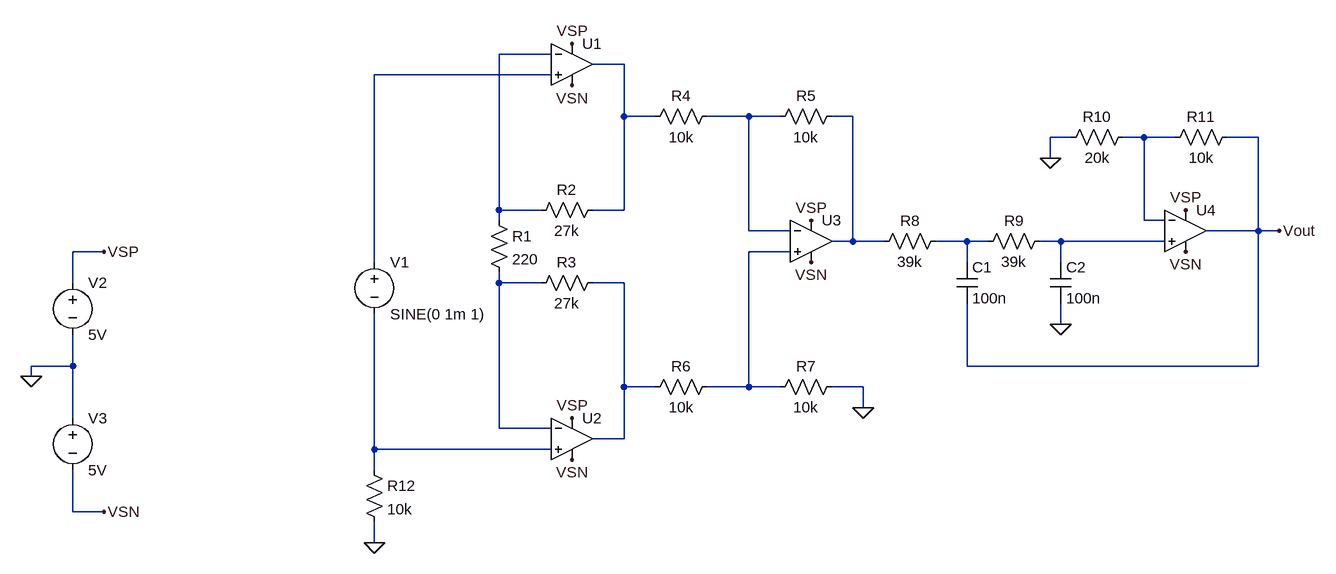
[diagram p0: schematic schema_ex1.asc]
schema_ex1.asc, the LTspice schematic file:
Version 4
SHEET 1 1656 700
WIRE 224 -96 144 -96
WIRE 336 -80 288 -80
WIRE 224 -64 -48 -64
WIRE 336 0 336 -80
WIRE 384 0 336 0
WIRE 528 0 464 0
WIRE 576 0 528 0
WIRE 688 0 656 0
WIRE 1024 32 992 32
WIRE 1136 32 1104 32
WIRE 1184 32 1136 32
WIRE 1312 32 1264 32
WIRE 992 64 992 32
WIRE 144 144 144 -96
WIRE 208 144 144 144
WIRE 336 144 336 0
WIRE 336 144 288 144
WIRE 144 160 144 144
WIRE 1136 160 1136 32
WIRE 1168 160 1136 160
WIRE 528 176 528 0
WIRE 592 176 528 176
WIRE 1312 176 1312 32
WIRE 1312 176 1232 176
WIRE 1344 176 1312 176
WIRE 688 192 688 0
WIRE 688 192 656 192
WIRE 736 192 688 192
WIRE 864 192 816 192
WIRE 896 192 864 192
WIRE 1008 192 976 192
WIRE 1168 192 1008 192
WIRE -464 208 -512 208
WIRE 592 208 528 208
WIRE -48 224 -48 -64
WIRE 864 224 864 192
WIRE 1008 224 1008 192
WIRE -512 256 -512 208
WIRE 144 256 144 240
WIRE 208 256 144 256
WIRE 336 256 288 256
WIRE 1008 320 1008 288
WIRE -512 384 -512 336
WIRE -512 384 -576 384
WIRE 864 384 864 288
WIRE 1312 384 1312 176
WIRE 1312 384 864 384
WIRE -576 400 -576 384
WIRE 336 416 336 256
WIRE 384 416 336 416
WIRE 528 416 528 208
WIRE 528 416 464 416
WIRE 576 416 528 416
WIRE 704 416 656 416
WIRE 704 448 704 416
WIRE -512 464 -512 384
WIRE 144 480 144 256
WIRE 224 480 144 480
WIRE 336 496 336 416
WIRE 336 496 288 496
WIRE -48 512 -48 304
WIRE 224 512 -48 512
WIRE -48 544 -48 512
WIRE -512 608 -512 544
WIRE -464 608 -512 608
WIRE -48 656 -48 624
FLAG 256 -112 VSP
FLAG -464 208 VSP
FLAG -464 608 VSN
FLAG 256 -48 VSN
FLAG -576 400 0
FLAG -48 656 0
FLAG 256 464 VSP
FLAG 624 160 VSP
FLAG 1200 144 VSP
FLAG 256 528 VSN
FLAG 624 224 VSN
FLAG 1200 208 VSN
FLAG 704 448 0
FLAG 1008 320 0
FLAG 992 64 0
FLAG 1344 176 Vout
SYMBOL OpAmps\\UniversalOpAmp2 256 -80 R0
SYMATTR InstName U1
SYMBOL voltage -48 208 R0
WINDOW 123 0 0 Left 0
WINDOW 39 0 0 Left 0
SYMATTR InstName V1
SYMATTR Value SINE(0 1m 1)
SYMBOL voltage -512 240 R0
WINDOW 123 0 0 Left 0
WINDOW 39 0 0 Left 0
SYMATTR InstName V2
SYMATTR Value 5V
SYMBOL voltage -512 448 R0
WINDOW 123 0 0 Left 0
WINDOW 39 0 0 Left 0
SYMATTR InstName V3
SYMATTR Value 5V
SYMBOL OpAmps\\UniversalOpAmp2 256 496 R0
SYMATTR InstName U2
SYMBOL OpAmps\\UniversalOpAmp2 624 192 R0
SYMATTR InstName U3
SYMBOL OpAmps\\UniversalOpAmp2 1200 176 R0
SYMATTR InstName U4
SYMBOL res -64 528 R0
SYMATTR InstName R12
SYMATTR Value 10k
SYMBOL res 128 144 R0
SYMATTR InstName R1
SYMATTR Value 220
SYMBOL res 304 128 R90
WINDOW 0 0 56 VBottom 2
WINDOW 3 32 56 VTop 2
SYMATTR InstName R2
SYMATTR Value 27k
SYMBOL res 304 240 R90
WINDOW 0 0 56 VBottom 2
WINDOW 3 32 56 VTop 2
SYMATTR InstName R3
SYMATTR Value 27k
SYMBOL res 480 -16 R90
WINDOW 0 0 56 VBottom 2
WINDOW 3 32 56 VTop 2
SYMATTR InstName R4
SYMATTR Value 10k
SYMBOL res 672 -16 R90
WINDOW 0 0 56 VBottom 2
WINDOW 3 32 56 VTop 2
SYMATTR InstName R5
SYMATTR Value 10k
SYMBOL res 480 400 R90
WINDOW 0 0 56 VBottom 2
WINDOW 3 32 56 VTop 2
SYMATTR InstName R6
SYMATTR Value 10k
SYMBOL res 672 400 R90
WINDOW 0 0 56 VBottom 2
WINDOW 3 32 56 VTop 2
SYMATTR InstName R7
SYMATTR Value 10k
SYMBOL res 832 176 R90
WINDOW 0 0 56 VBottom 2
WINDOW 3 32 56 VTop 2
SYMATTR InstName R8
SYMATTR Value 39k
SYMBOL res 992 176 R90
WINDOW 0 0 56 VBottom 2
WINDOW 3 32 56 VTop 2
SYMATTR InstName R9
SYMATTR Value 39k
SYMBOL cap 848 224 R0
SYMATTR InstName C1
SYMATTR Value 100n
SYMBOL cap 992 224 R0
SYMATTR InstName C2
SYMATTR Value 100n
SYMBOL res 1120 16 R90
WINDOW 0 0 56 VBottom 2
WINDOW 3 32 56 VTop 2
SYMATTR InstName R10
SYMATTR Value 20k
SYMBOL res 1280 16 R90
WINDOW 0 0 56 VBottom 2
WINDOW 3 32 56 VTop 2
SYMATTR InstName R11
SYMATTR Value 10k

The netlist it stands for:
* schema_ex1.asc
XU1 N003 N001 VSP VSN N002 level2 Avol=1Meg GBW=10Meg Slew=10Meg Ilimit=25m Rail=0 Vos=0 En=0 Enk=0 In=0 Ink=0 Rin=500Meg  ; pins In+ In- V+ V- OUT
V1 N003 N012 SINE(0 1m 1)
V2 VSP 0 5V
V3 0 VSN 5V
XU2 N012 N010 VSP VSN N011 level2 Avol=1Meg GBW=10Meg Slew=10Meg Ilimit=25m Rail=0 Vos=0 En=0 Enk=0 In=0 Ink=0 Rin=500Meg  ; pins In+ In- V+ V- OUT
XU3 N009 N004 VSP VSN N005 level2 Avol=1Meg GBW=10Meg Slew=10Meg Ilimit=25m Rail=0 Vos=0 En=0 Enk=0 In=0 Ink=0 Rin=500Meg  ; pins In+ In- V+ V- OUT
XU4 N008 N006 VSP VSN Vout level2 Avol=1Meg GBW=10Meg Slew=10Meg Ilimit=25m Rail=0 Vos=0 En=0 Enk=0 In=0 Ink=0 Rin=500Meg  ; pins In+ In- V+ V- OUT
R12 N012 0 10k
R1 N001 N010 220
R2 N002 N001 27k
R3 N011 N010 27k
R4 N004 N002 10k
R5 N005 N004 10k
R6 N009 N011 10k
R7 0 N009 10k
R8 N007 N005 39k
R9 N008 N007 39k
C1 N007 Vout 100n
C2 N008 0 100n
R10 N006 0 20k
R11 Vout N006 10k
.lib UniversalOpAmp2.lib
.backanno
.end